# Altium schematic sheet battery current sensor.SchDoc
size A
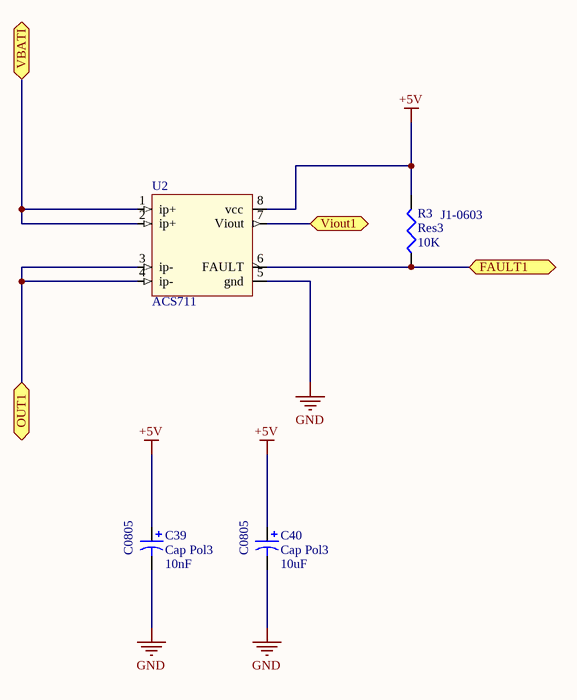
[diagram p0: battery current sensor.SchDoc]

## Parts
C39  Cap Pol3  value 10nF  [C0805]
C40  Cap Pol3  value 10uF  [C0805]
R3  Res3  value 10K  [J1-0603]
U2  ACS711  [ACS711]

## Ports
FAULT1, OUT1, VBATI, Viout1

## Nets
+5V: C39.1 C40.1 R3.2 U2.8(vcc)
GND: C39.2 C40.2 U2.5(gnd)
FAULT1: R3.1 U2.6(FAULT) ; port FAULT1
OUT1: U2.3(ip-) U2.4(ip-) ; port OUT1
VBATI: U2.1(ip+) U2.2(ip+) ; port VBATI
Viout1: U2.7(Viout) ; port Viout1

## Library data of the parts
C39 C40 = Cap Pol3: Polarized Capacitor (Surface Mount); Published: 8-Jun-2000; LatestRevisionDate: 29-May-2009; LatestRevisionNote: IPC-7351 Footprint Added.; PackageReference: C0805; Publisher: Altium Limited; PackageDescription: Chip Capacitor
R3 = Res3: Resistor; Published: 8-Jun-2000; LatestRevisionDate: 29-May-2009; LatestRevisionNote: IPC-7351 Footprint Added.; PackageReference: J1-0603; Publisher: Altium Limited; PackageDescription: Chip Resistor